# EAGLE schematic bmp_entropia (EAGLE 6.4)
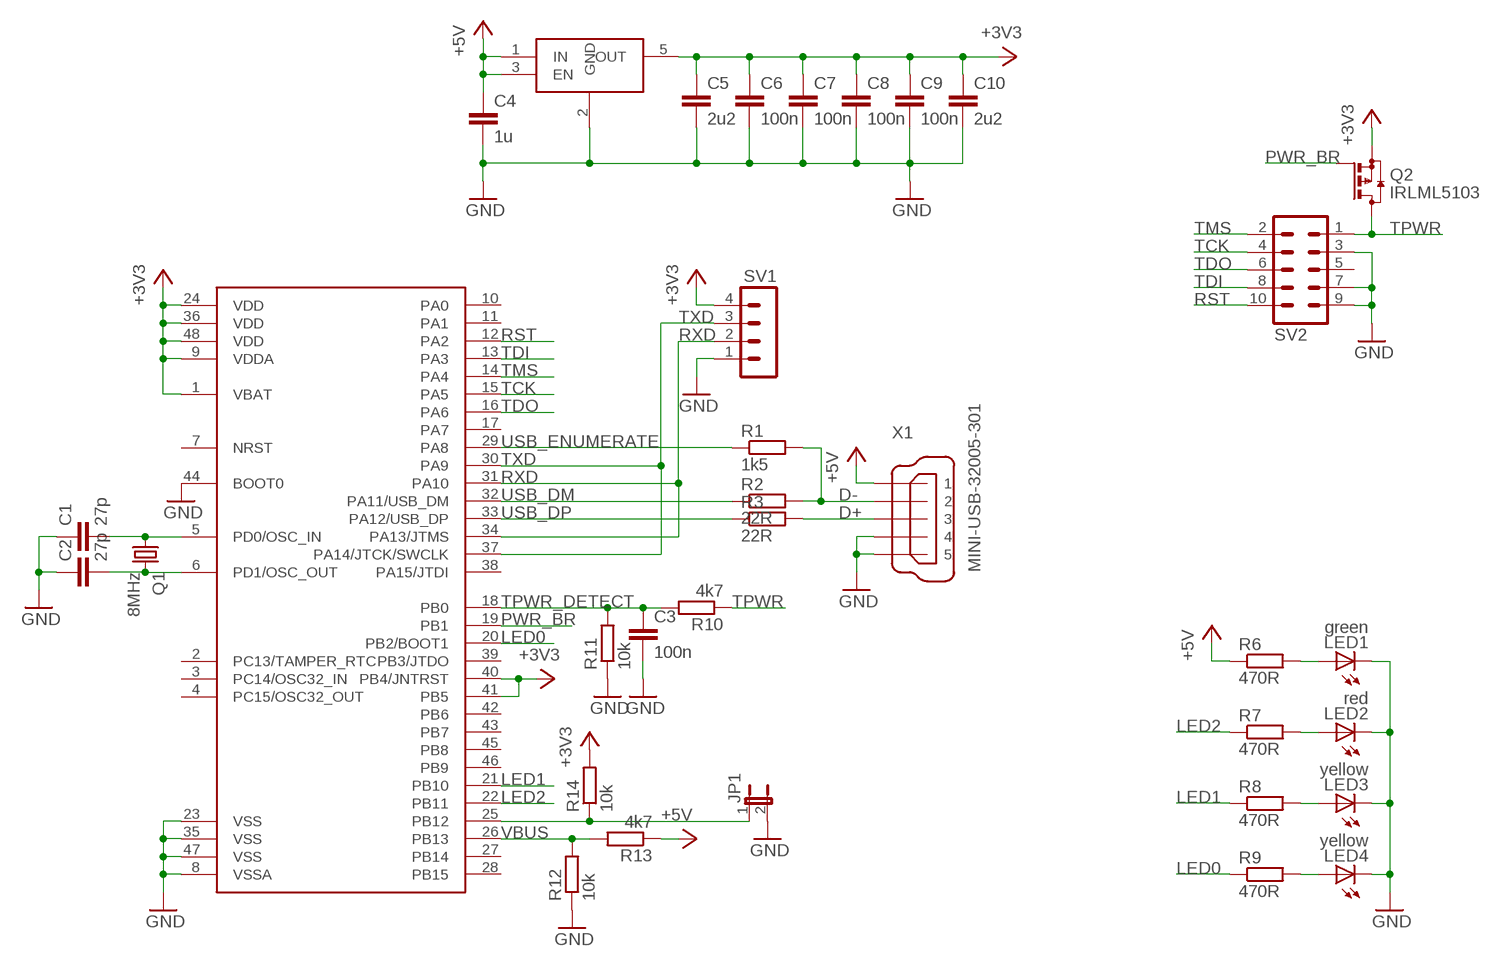
[diagram p0: schematic, sheet 1]

## Parts
C1  27p  C-EUC0603  [C0603]
C2  27p  C-EUC0603  [C0603]
C3  100n  C-EUC0603  [C0603]
C4  1u  C-EUC0603  [C0603]
C5  2u2  C-EUC0603  [C0603]
C6  100n  C-EUC0603  [C0603]
C7  100n  C-EUC0603  [C0603]
C8  100n  C-EUC0603  [C0603]
C9  100n  C-EUC0603  [C0603]
C10  2u2  C-EUC0603  [C0603]
JP1  JP1E  [JP1]
LED1  green  LEDCHIPLED_0603  [CHIPLED_0603]
LED2  red  LEDCHIPLED_0603  [CHIPLED_0603]
LED3  yellow  LEDCHIPLED_0603  [CHIPLED_0603]
LED4  yellow  LEDCHIPLED_0603  [CHIPLED_0603]
Q1  8MHz  CRYSTALHC49S  [HC49/S]
Q2  IRLML5103  BSS84  [SOT23]
R1  1k5  R-EU_R0603  [R0603]
R2  22R  R-EU_R0603  [R0603]
R3  22R  R-EU_R0603  [R0603]
R6  470R  R-EU_R0603  [R0603]
R7  470R  R-EU_R0603  [R0603]
R8  470R  R-EU_R0603  [R0603]
R9  470R  R-EU_R0603  [R0603]
R10  4k7  R-EU_R0603  [R0603]
R11  10k  R-EU_R0603  [R0603]
R12  10k  R-EU_R0603  [R0603]
R13  4k7  R-EU_R0603  [R0603]
R14  10k  R-EU_R0603  [R0603]
SV1  MA04-1  [MA04-1]
SV2  MA05-2  [MA05-2]
U$1  STM32F_48PIN  [TQFP48]
U$2  TLV70033DCK  TLV700DCK  [SC70-5L]
X1  MINI-USB-32005-301  [32005-301]

## Nets
+3V3: C5.1 C6.1 C7.1 C8.1 C9.1 C10.1 Q2.2(S) R14.2 SV1.4 U$1.1(VBAT) U$1.9(VDDA) U$1.24(VDD) U$1.36(VDD) U$1.40(PB4/JNTRST) U$1.41(PB5) U$1.48(VDD) U$2.5(OUT)
+5V: C4.1 R6.1 R13.1 U$2.1(IN) U$2.3(EN) X1.1
D+: R3.2 X1.3
D-: R1.2 R2.2 X1.2
GND: C1.1 C2.1 C3.2 C4.2 C5.2 C6.2 C7.2 C8.2 C9.2 C10.2 JP1.2 LED1.C LED2.C LED3.C LED4.C R11.1 R12.1 SV1.1 SV2.3 SV2.7 SV2.9 U$1.8(VSSA) U$1.23(VSS) U$1.35(VSS) U$1.44(BOOT0) U$1.47(VSS) U$2.2(GND) X1.4 X1.5
LED0: R9.1 U$1.20(PB2/BOOT1)
LED1: R8.1 U$1.21(PB10)
LED2: R7.1 U$1.22(PB11)
LED_G: LED1.A R6.2
LED_R: LED2.A R7.2
LED_Y0: LED4.A R9.2
LED_Y1: LED3.A R8.2
OSC_IN: C1.2 Q1.1 U$1.5(PD0/OSC_IN)
OSC_OUT: C2.2 Q1.2 U$1.6(PD1/OSC_OUT)
PWR_BR: Q2.1(G) U$1.19(PB1)
RST: SV2.10 U$1.12(PA2)
RXD: SV1.2 U$1.31(PA10) U$1.34(PA13/JTMS)
TASTER: JP1.1 R14.1 U$1.25(PB12)
TCK: SV2.4 U$1.15(PA5)
TDI: SV2.8 U$1.13(PA3)
TDO: SV2.6 U$1.16(PA6)
TMS: SV2.2 U$1.14(PA4)
TPWR: Q2.3(D) R10.1 SV2.1
TPWR_DETECT: C3.1 R10.2 R11.2 U$1.18(PB0)
TXD: SV1.3 U$1.30(PA9) U$1.37(PA14/JTCK/SWCLK)
USB_DM: R2.1 U$1.32(PA11/USB_DM)
USB_DP: R3.1 U$1.33(PA12/USB_DP)
USB_ENUMERATE: R1.1 U$1.29(PA8)
VBUS: R12.2 R13.2 U$1.26(PB13)
Unconnected: SV2.5 U$1.2(PC13/TAMPER_RTC) U$1.3(PC14/OSC32_IN) U$1.4(PC15/OSC32_OUT) U$1.7(NRST) U$1.10(PA0) U$1.11(PA1) U$1.17(PA7) U$1.27(PB14) U$1.28(PB15) U$1.38(PA15/JTDI) U$1.39(PB3/JTDO) U$1.42(PB6) U$1.43(PB7) U$1.45(PB8) U$1.46(PB9)

## Library data of the parts
C1-C10 = rcl:C-EU: CAPACITOR, European symbol
JP1 = jumper:JP1E: JUMPER
LED1-LED4 = led:LED: LED OSRAM: - CHIPLED LG R971, LG N971, LY N971, LG Q971, LY Q971, LO R971, LY R971 LH N974, LH R974 LS Q976, LO Q976, LY Q976 LO Q996 - Hyper CHIPLED LW Q18S LB Q993, LB Q99A, LB R99A - SideLED LS A670, LO A670, LY A670, LG A670, LP A670 LB A673, LV A673, LT A673, LW A673 LH A674 LY A675 LS A676, LA A676, LO A676, LY A676, LW A676 LS A679, LY A679, LG A679 - Hyper Micro SIDELED® LS Y876, LA Y876, LO Y876, LY Y876 LT Y87S - SmartLED LW L88C, LW L88S LB L89C, LB L89S, LG L890 LS L89K, LO L89K, LY L89K LS L896, LA L896, LO L896, LY L896 - TOPLED LS T670, LO T670, LY T670, LG T670, LP T670 LSG T670, LSP T670, LSY T670, LOP T670, LYG T670 LG T671, LOG T671, LSG T671 LB T673, LV T673, LT T673, LW T673 LH T674 LS T676, LA T676, LO T676, LY T676, LB T676, LH T676, LSB T676, LW T676 LB T67C, LV T67C, LT T67C, LS T67K, LO T67K, LY T67K, LW E67C LS E67B, LA E67B, LO E67B, LY E67B, LB E67C, LV E67C, LT E67C LW T67C LS T679, LY T679, LG T679 LS T770, LO T770, LY T770, LG T770, LP T770 LB T773, LV T773, LT T773, LW T773 LH T774 LS E675, LA E675, LY E675, LS T675 LS T776, LA T776, LO T776, LY T776, LB T776 LHGB T686 LT T68C, LB T68C - Hyper Mini TOPLED® LB M676 - Mini TOPLED Santana® LG M470 LS M47K, LO M47K, LY M47K Source: http://www.osram.convergy.de LUXEON: - LUMILED® LXK2-PW12-R00, LXK2-PW12-S00, LXK2-PW14-U00, LXK2-PW14-V00 LXK2-PM12-R00, LXK2-PM12-S00, LXK2-PM14-U00 LXK2-PE12-Q00, LXK2-PE12-R00, LXK2-PE12-S00, LXK2-PE14-T00, LXK2-PE14-U00 LXK2-PB12-K00, LXK2-PB12-L00, LXK2-PB12-M00, LXK2-PB14-N00, LXK2-PB14-P00, LXK2-PB14-Q00 LXK2-PR12-L00, LXK2-PR12-M00, LXK2-PR14-Q00, LXK2-PR14-R00 LXK2-PD12-Q00, LXK2-PD12-R00, LXK2-PD12-S00 LXK2-PH12-R00, LXK2-PH12-S00 LXK2-PL12-P00, LXK2-PL12-Q00, LXK2-PL12-R00 Source: www.luxeon.com KINGBRIGHT: KA-3528ASYC Source: www.kingbright.com
Q1 = crystal:CRYSTAL: CRYSTAL; OC_FARNELL: 1667008; OC_NEWARK: unknown
Q2 = transistor-small-signal:BSS84: P-CHANNEL MOS FET
R1-R3 R6-R14 = rcl:R-EU_: RESISTOR, European symbol
SV1 = con-lstb:MA04-1: PIN HEADER; OC_FARNELL: unknown; OC_NEWARK: unknown
SV2 = con-lstb:MA05-2: PIN HEADER; OC_FARNELL: unknown; OC_NEWARK: unknown
U$1 = stm32f:STM32F_48PIN
U$2 = tlv700:TLV700
X1 = con-cypressindustries:MINI-USB-: MINI USB-B Conector Source: www.cypressindustries.com; OC_FARNELL: unknown; OC_NEWARK: unknown